# EAGLE design cart-breakout-r2 (EAGLE 8.3.1)
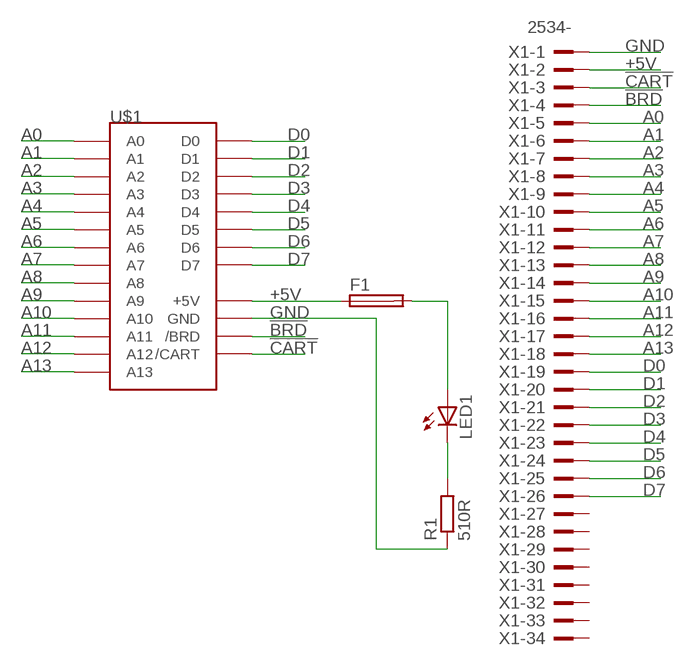
[diagram p0: schematic, sheet 1]

## Parts
F1  TE5  [TE5]
LED1  LED5MM  [LED5MM]
R1  510R  R-EU_0204/7  [0204/7]
U$1  TVC-CART-EDGE+  [TVC-CART-EDGE]
X1  2534-  [PAK100/2500-34]

## Nets
!BRD: U$1.BTM24(/BRD) X1.4
!CART: U$1.BTM23(/CART) X1.3
+5V: F1.1 F1.2 LED1.A U$1.BTM10(+5V) U$1.BTM11(+5V) U$1.BTM12(+5V) U$1.BTM13(+5V) U$1.BTM14(+5V) U$1.BTM15(+5V) U$1.BTM16(+5V) U$1.BTM17(+5V) X1.2
A0: U$1.TOP25(A0) X1.5
A1: U$1.TOP2(A1) X1.6
A2: U$1.TOP24(A2) X1.7
A3: U$1.TOP1(A3) X1.8
A4: U$1.TOP21(A4) X1.9
A5: U$1.TOP14(A5) X1.10
A6: U$1.TOP18(A6) X1.11
A7: U$1.TOP17(A7) X1.12
A8: U$1.TOP15(A8) X1.13
A9: U$1.TOP19(A9) X1.14
A10: U$1.TOP22(A10) X1.15
A11: U$1.TOP20(A11) X1.16
A12: U$1.TOP16(A12) X1.17
A13: U$1.TOP23(A13) X1.18
D0: U$1.TOP4(D0) X1.19
D1: U$1.TOP5(D1) X1.20
D2: U$1.TOP6(D2) X1.21
D3: U$1.TOP7(D3) X1.22
D4: U$1.TOP8(D4) X1.23
D5: U$1.TOP9(D5) X1.24
D6: U$1.TOP10(D6) X1.25
D7: U$1.TOP3(D7) X1.26
GND: R1.1 U$1.BTM1(GND) U$1.BTM2(GND) U$1.BTM3(GND) U$1.BTM4(GND) U$1.BTM5(GND) U$1.BTM6(GND) U$1.BTM7(GND) U$1.BTM8(GND) X1.1
N$1: LED1.K(C) R1.2
Unconnected: X1.27 X1.28 X1.29 X1.30 X1.31 X1.32 X1.33 X1.34

## Library data of the parts
F1 = fuse:TE5: FUSE Wickmann; OC_FARNELL: unknown; OC_NEWARK: unknown
LED1 = led:LED: LED OSRAM: - CHIPLED LG R971, LG N971, LY N971, LG Q971, LY Q971, LO R971, LY R971 LH N974, LH R974 LS Q976, LO Q976, LY Q976 LO Q996 - Hyper CHIPLED LW Q18S LB Q993, LB Q99A, LB R99A - SideLED LS A670, LO A670, LY A670, LG A670, LP A670 LB A673, LV A673, LT A673, LW A673 LH A674 LY A675 LS A676, LA A676, LO A676, LY A676, LW A676 LS A679, LY A679, LG A679 - Hyper Micro SIDELED® LS Y876, LA Y876, LO Y876, LY Y876 LT Y87S - SmartLED LW L88C, LW L88S LB L89C, LB L89S, LG L890 LS L89K, LO L89K, LY L89K LS L896, LA L896, LO L896, LY L896 - TOPLED LS T670, LO T670, LY T670, LG T670, LP T670 LSG T670, LSP T670, LSY T670, LOP T670, LYG T670 LG T671, LOG T671, LSG T671 LB T673, LV T673, LT T673, LW T673 LH T674 LS T676, LA T676, LO T676, LY T676, LB T676, LH T676, LSB T676, LW T676 LB T67C, LV T67C, LT T67C, LS T67K, LO T67K, LY T67K, LW E67C LS E67B, LA E67B, LO E67B, LY E67B, LB E67C, LV E67C, LT E67C LW T67C LS T679, LY T679, LG T679 LS T770, LO T770, LY T770, LG T770, LP T770 LB T773, LV T773, LT T773, LW T773 LH T774 LS E675, LA E675, LY E675, LS T675 LS T776, LA T776, LO T776, LY T776, LB T776 LHGB T686 LT T68C, LB T68C - Hyper Mini TOPLED® LB M676 - Mini TOPLED Santana® LG M470 LS M47K, LO M47K, LY M47K Source: http://www.osram.convergy.de LUXEON: - LUMILED® LXK2-PW12-R00, LXK2-PW12-S00, LXK2-PW14-U00, LXK2-PW14-V00 LXK2-PM12-R00, LXK2-PM12-S00, LXK2-PM14-U00 LXK2-PE12-Q00, LXK2-PE12-R00, LXK2-PE12-S00, LXK2-PE14-T00, LXK2-PE14-U00 LXK2-PB12-K00, LXK2-PB12-L00, LXK2-PB12-M00, LXK2-PB14-N00, LXK2-PB14-P00, LXK2-PB14-Q00 LXK2-PR12-L00, LXK2-PR12-M00, LXK2-PR14-Q00, LXK2-PR14-R00 LXK2-PD12-Q00, LXK2-PD12-R00, LXK2-PD12-S00 LXK2-PH12-R00, LXK2-PH12-S00 LXK2-PL12-P00, LXK2-PL12-Q00, LXK2-PL12-R00 Source: www.luxeon.com KINGBRIGHT: KA-3528ASYC Source: www.kingbright.com
R1 = rcl:R-EU_: RESISTOR, European symbol
U$1 = tvc-cart:TVC-CART-EDGE+: Videoton TV Computer cartridge connector for TVC 64k+ (32k and 64k has FAST and /RD is not gated)
X1 = con-3m:2534-: 3M (TM) Pak 100 4-Wall Header Source: 3M; OC_FARNELL: unknown; OC_NEWARK: unknown

## Board
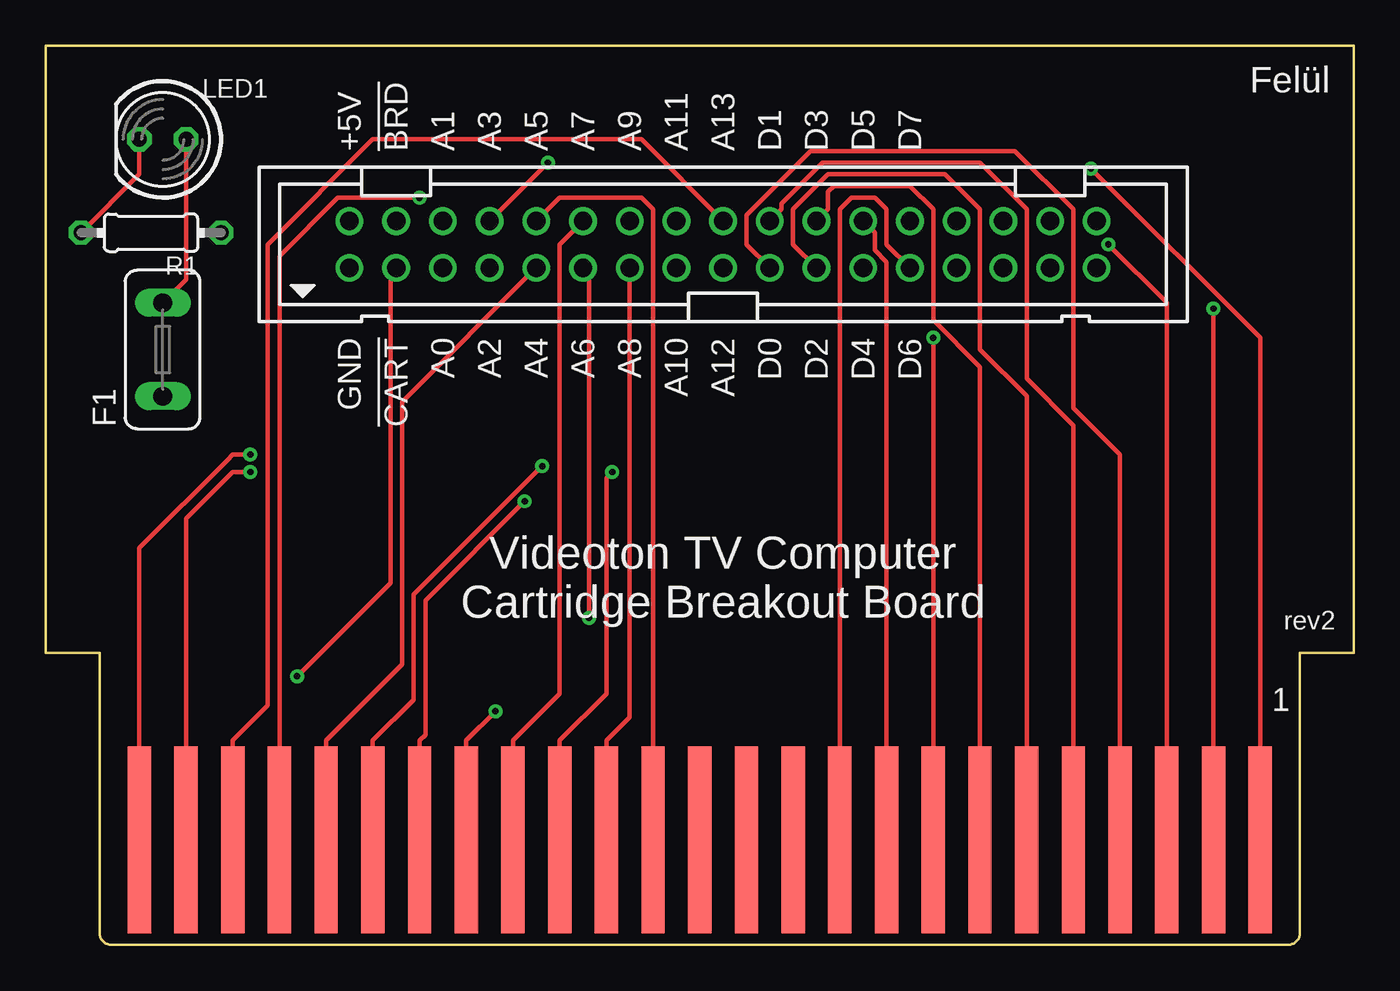
[diagram p1: board, top side]
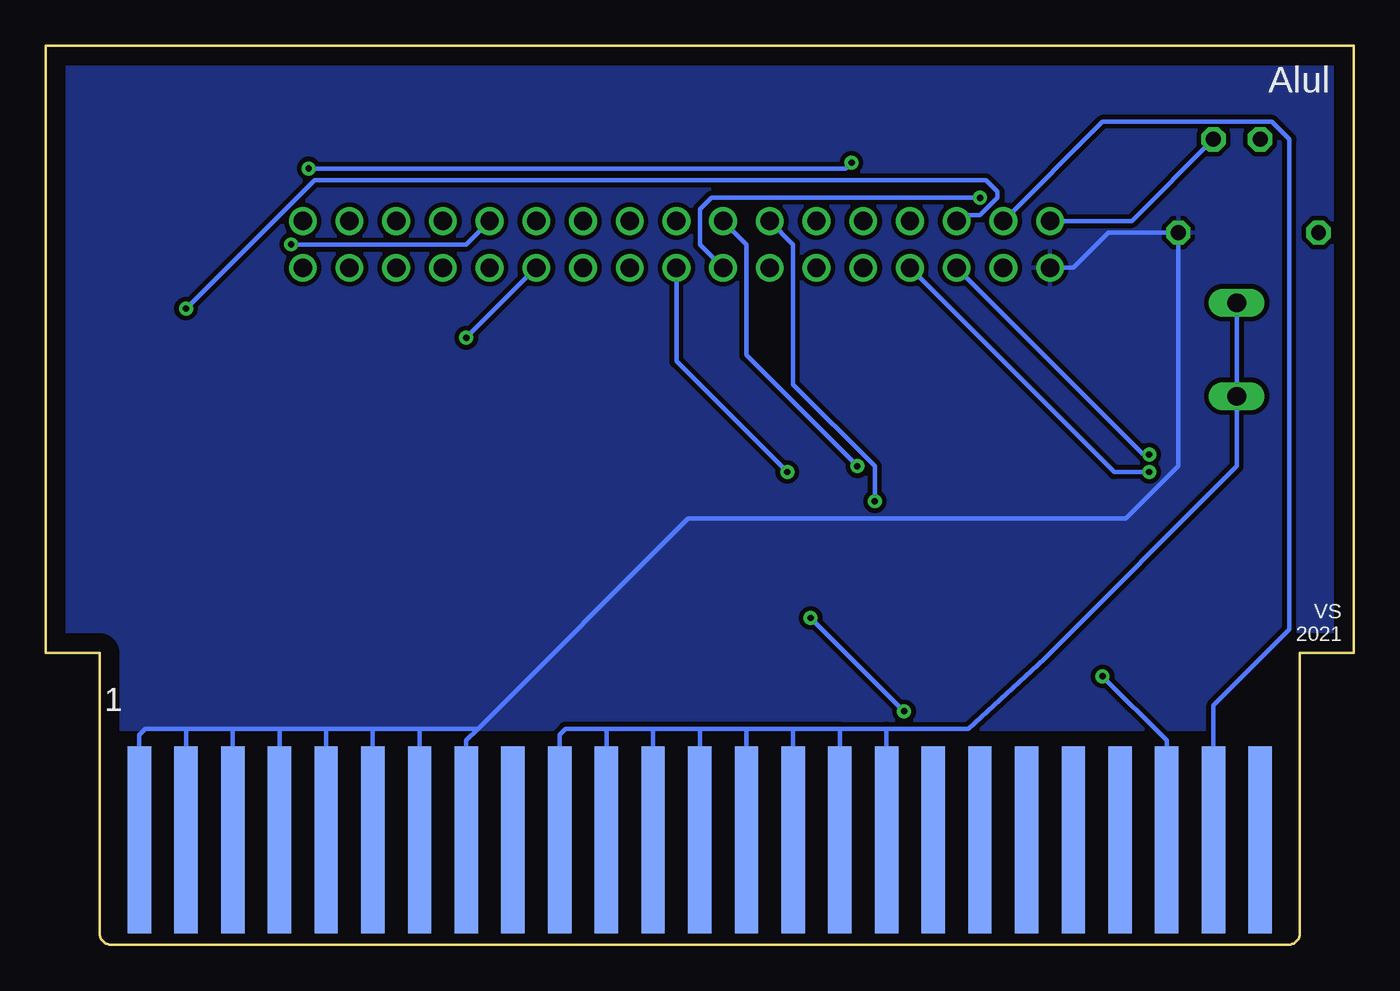
[diagram p2: board, bottom side, seen from below]

Size 71.12 x 48.9 mm. Coordinates in mm from the lower left corner, seen from the top.
Outline: 1.27,15.88 0,15.88 0,48.9 71.12,48.9 71.12,15.88 69.85,15.88
Copper layers (1*16): Top 0.035mm / dielectric 1.5mm / Bottom 0.035mm
Design rules "default *": minimum track width 10mil, minimum drill 0.35mm, track to track 10mil, track to pad 6mil, pad to pad 6mil, via to via 6mil, smd to smd 6mil, copper to edge 40mil, drill to drill 6mil, minimum pad ring 10mil, minimum via ring 8mil, stop-mask expansion 4mil, vias tented up to drill 0mil, thermal gap 10mil

### Footprints (pad centres in the part's own frame; a part is rotated, then mirrored left to right if it is on the bottom)
TE5 = drill 1.016 long: 1 -2.54,0; 2 2.54,0
LED5MM = drill 0.813 octagon: A -1.27,0; K 1.27,0
0204/7 = drill 0.813 octagon: 1 -3.81,0; 2 3.81,0
TVC-CART-EDGE = smd 1.27 x 10.16 bottom: BTM1 29.21,-6.35; BTM2 26.67,-6.35; BTM3 24.13,-6.35; BTM4 21.59,-6.35; BTM5 19.05,-6.35; BTM6 16.51,-6.35; BTM7 13.97,-6.35; BTM8 11.43,-6.35; BTM9 8.89,-6.35; BTM10 6.35,-6.35; BTM11 3.81,-6.35; BTM12 1.27,-6.35; BTM13 -1.27,-6.35; BTM14 -3.81,-6.35; BTM15 -6.35,-6.35; BTM16 -8.89,-6.35; BTM17 -11.43,-6.35; BTM18 -13.97,-6.35; BTM19 -16.51,-6.35; BTM20 -19.05,-6.35; BTM21 -21.59,-6.35; BTM22 -24.13,-6.35; BTM23 -26.67,-6.35; BTM24 -29.21,-6.35; BTM25 -31.75,-6.35 | smd 1.27 x 10.16: TOP1 29.21,-6.35; TOP2 26.67,-6.35; TOP3 24.13,-6.35; TOP4 21.59,-6.35; TOP5 19.05,-6.35; TOP6 16.51,-6.35; TOP7 13.97,-6.35; TOP8 11.43,-6.35; TOP9 8.89,-6.35; TOP10 6.35,-6.35; TOP11 3.81,-6.35; TOP12 1.27,-6.35; TOP13 -1.27,-6.35; TOP14 -3.81,-6.35; TOP15 -6.35,-6.35; TOP16 -8.89,-6.35; TOP17 -11.43,-6.35; TOP18 -13.97,-6.35; TOP19 -16.51,-6.35; TOP20 -19.05,-6.35; TOP21 -21.59,-6.35; TOP22 -24.13,-6.35; TOP23 -26.67,-6.35; TOP24 -29.21,-6.35; TOP25 -31.75,-6.35
PAK100/2500-34 = drill 1 pad 1.422: 1 -20.32,-1.27; 2 -20.32,1.27; 3 -17.78,-1.27; 4 -17.78,1.27; 5 -15.24,-1.27; 6 -15.24,1.27; 7 -12.7,-1.27; 8 -12.7,1.27; 9 -10.16,-1.27; 10 -10.16,1.27; 11 -7.62,-1.27; 12 -7.62,1.27; 13 -5.08,-1.27; 14 -5.08,1.27; 15 -2.54,-1.27; 16 -2.54,1.27; 17 0,-1.27; 18 0,1.27; 19 2.54,-1.27; 20 2.54,1.27; 21 5.08,-1.27; 22 5.08,1.27; 23 7.62,-1.27; 24 7.62,1.27; 25 10.16,-1.27; 26 10.16,1.27; 27 12.7,-1.27; 28 12.7,1.27; 29 15.24,-1.27; 30 15.24,1.27; 31 17.78,-1.27; 32 17.78,1.27; 33 20.32,-1.27; 34 20.32,1.27

### Placement (x,y rotation side)
F1  6.35,32.39 90 top
LED1  6.35,43.82 180 top
R1  5.71,38.73 180 top
U$1  36.83,12.06 0 top
X1  36.83,38.1 0 top

### Tracks (layer width: path | path; a pad name or v marks a point on that pad's centre or on a via)
!BRD
  Bottom 0.254: X1.4 13.65,44.77 4.45,44.77 3.49,43.82 3.49,17.15 7.62,13.02 U$1.BTM24
!CART  (via drill 0.35)
  Top 0.254: X1.3 18.73,36.51 18.73,19.69 v13.65,14.61
  Bottom 0.254: v13.65,14.61 10.16,11.11 U$1.BTM23
+5V
  Top 0.254: F1.2 7.62,36.2 LED1.A
  Bottom 0.254: F1.2 F1.1 6.35,26.04 16.83,15.56 20.95,11.75 25.4,11.75 | LED1.A 12.06,39.37 X1.2 | 25.4,11.75 U$1.BTM17 | 27.94,11.75 25.4,11.75 | U$1.BTM16 27.94,11.75 | 30.48,11.75 U$1.BTM15 | 27.94,11.75 30.48,11.75 | 33.02,11.75 U$1.BTM14 | 30.48,11.75 33.02,11.75 | 35.56,11.75 U$1.BTM13 | 33.02,11.75 35.56,11.75 | 38.1,11.75 U$1.BTM12 | 35.56,11.75 38.1,11.75 | 40.64,11.75 U$1.BTM11 | 38.1,11.75 40.64,11.75 | 40.64,11.75 42.86,11.75 43.18,11.43 U$1.BTM10
A0  (via drill 0.35)
  Top 0.254: v11.11,26.67 10.16,26.67 9.84,26.35 5.08,21.59 U$1.TOP25
  Bottom 0.254: X1.5 11.43,26.67 v11.11,26.67
A1  (via drill 0.35)
  Top 0.254: U$1.TOP2 v63.5,34.61
  Bottom 0.254: X1.6 21.27,39.69 20.32,39.69 19.37,40.64 19.37,40.96 20,41.59 56.52,41.59 v63.5,34.61
A2  (via drill 0.35)
  Top 0.254: v11.11,25.72 10.16,25.72 7.62,23.18 U$1.TOP24
  Bottom 0.254: X1.7 13.02,25.72 v11.11,25.72
A3  (via drill 0.35)
  Top 0.254: v27.3,42.55 X1.8 | v56.83,42.23 66.04,33.02 U$1.TOP1
  Bottom 0.254: v27.3,42.55 27.62,42.23 v56.83,42.23
A4
  Top 0.254: X1.9 19.37,29.53 19.37,15.24 15.24,11.11 U$1.TOP21
A5
  Top 0.254: X1.10 27.94,40.64 32.38,40.64 33.02,40.01 U$1.TOP14
A6  (via drill 0.35)
  Top 0.254: X1.11 29.53,36.51 v29.53,17.78 | v24.45,12.7 22.86,11.11 U$1.TOP18
  Bottom 0.254: v24.45,12.7 v29.53,17.78
A7
  Top 0.254: X1.12 27.94,38.1 27.94,13.65 25.4,11.11 U$1.TOP17
A8
  Top 0.254: X1.13 31.75,12.38 30.48,11.11 U$1.TOP15
A9  (via drill 0.35)
  Top 0.254: v26.03,24.13 20.64,18.73 20.64,11.43 20.32,11.11 20.32,9.21 20.64,6.03 U$1.TOP19
  Bottom 0.254: X1.14 30.48,38.1 30.48,30.48 26.03,26.04 v26.03,24.13
A10  (via drill 0.35)
  Top 0.254: U$1.TOP22 12.7,37.47 15.88,40.64 v20.32,40.64
  Bottom 0.254: X1.15 35.56,38.1 35.56,40.01 34.92,40.64 v20.32,40.64
A11  (via drill 0.35)
  Top 0.254: v26.99,26.04 20,19.05 20,13.34 17.78,11.11 U$1.TOP20
  Bottom 0.254: X1.16 33.02,38.1 33.02,32.07 v26.99,26.04
A12  (via drill 0.35)
  Top 0.254: v30.8,25.72 30.48,25.4 30.48,13.65 27.94,11.11 U$1.TOP16
  Bottom 0.254: v30.8,25.72 36.83,31.75 X1.17
A13
  Top 0.254: X1.18 32.38,43.82 17.78,43.82 12.06,38.1 12.06,13.02 10.16,11.11 U$1.TOP23
D0
  Top 0.254: X1.19 38.1,38.1 38.1,39.69 41.59,43.18 52.7,43.18 55.88,40.01 55.88,29.21 58.42,26.67 U$1.TOP4
D1
  Top 0.254: X1.20 40.01,40.01 40.01,40.32 42.23,42.55 50.8,42.55 53.34,40.01 53.34,30.8 55.88,28.26 U$1.TOP5
D2
  Top 0.254: X1.21 40.64,38.1 40.64,40.01 42.55,41.91 48.89,41.91 50.8,40.01 50.8,32.39 53.34,29.84 U$1.TOP6
D3
  Top 0.254: X1.22 42.55,40.01 42.55,40.96 42.86,41.27 46.99,41.27 48.26,40.01 48.26,33.97 50.8,31.43 U$1.TOP7
D4  (via drill 0.35)
  Top 0.254: U$1.TOP8 v48.26,33.02
  Bottom 0.254: v48.26,33.02 X1.23
D5
  Top 0.254: X1.24 45.09,38.73 45.09,37.78 45.72,37.15 U$1.TOP9
D6
  Top 0.254: X1.25 45.72,38.1 45.72,40.01 45.09,40.64 43.81,40.64 43.18,40.01 U$1.TOP10
D7  (via drill 0.35)
  Top 0.254: v57.78,38.1 60.96,34.93 U$1.TOP3
  Bottom 0.254: X1.26 48.26,38.1 v57.78,38.1
GND
  Bottom 0.254: 47.62,11.75 48.26,11.11 U$1.BTM8 | 47.62,11.75 36.2,23.18 12.38,23.18 9.52,26.04 R1.1 13.34,38.73 15.24,36.83 X1.1 | 50.8,11.75 U$1.BTM7 | 47.62,11.75 50.8,11.75 | 53.34,11.75 U$1.BTM6 | 50.8,11.75 53.34,11.75 | 55.88,11.75 U$1.BTM5 | 53.34,11.75 55.88,11.75 | 58.42,11.75 U$1.BTM4 | 55.88,11.75 58.42,11.75 | 60.96,11.75 U$1.BTM3 | 58.42,11.75 60.96,11.75 | 63.5,11.75 U$1.BTM2 | 60.96,11.75 63.5,11.75 | 63.5,11.75 65.72,11.75 66.04,11.43 U$1.BTM1
  pour Bottom: -0.32,49.53 -0.32,14.61 2.54,11.75 68.58,11.75 68.9,11.43 68.9,12.38 72.07,15.56 72.07,48.9 71.44,49.53
N$1
  Top 0.254: R1.2 5.08,41.91 LED1.K

### Text on the board
tPlace: Felül | +5V | !BRD | A1 | A3 | A5 | A7 | A9 | A11 | A13 | D1 | D3 | D5 | D7 | GND | !CART | A0 | A2 | A4 | A6 | A8 | A10 | A12 | D0 | D2 | D4 | D6 | Videoton TV Computer / Cartridge Breakout Board | rev2
bPlace: Alul | VS / 2021
_tNames: X1